# EAGLE design Escorna_CPU_2_12 (EAGLE 6.4)
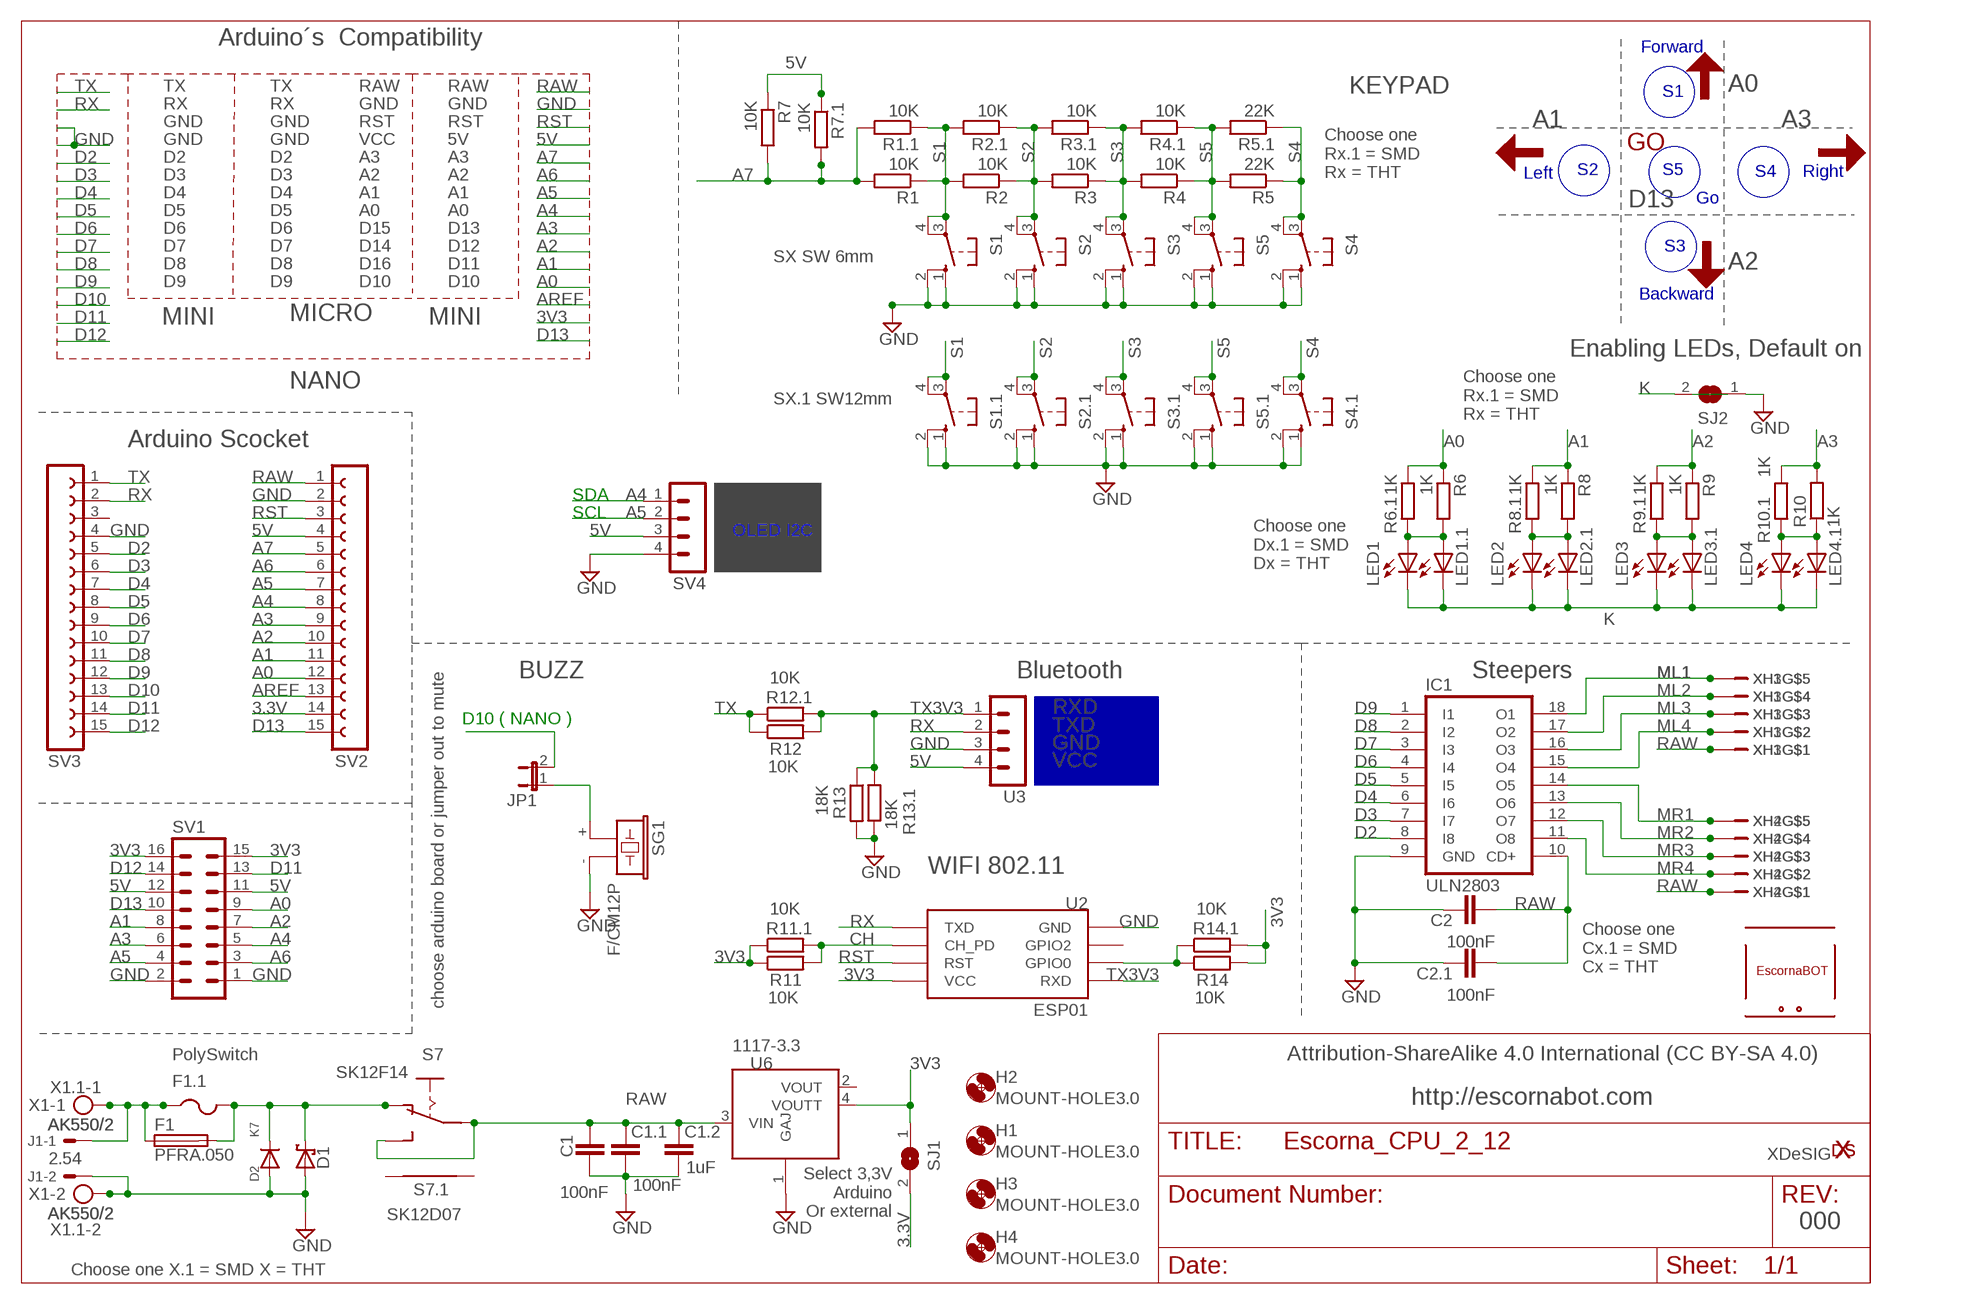
[diagram p0: schematic, sheet 1]

## Parts
C1  100nF  C-EU025-025X050  [C025-025X050]
C1.1  100nF  C-EUC1206  [C1206]
C1.2  1uF  C-EUC1206  [C1206]
C2  100nF  C-EU025-025X050  [C025-025X050]
C2.1  100nF  C-EUC1206  [C1206]
D1  1N5817  P4KEXX  [DO41-10]
D2  K7  DIODESMA  [SMADIODE]
ESC  ESCORNABOT  [ESCORNA_PEQUE]
F1  PFRA.050  FUSETE5  [TE5]
F1.1  PolySwitch  PTCFUSE-1206  [R1206]
H1  MOUNT-HOLE3.0  [3,0]
H2  MOUNT-HOLE3.0  [3,0]
H3  MOUNT-HOLE3.0  [3,0]
H4  MOUNT-HOLE3.0  [3,0]
IC1  ULN2803  ULN2803A  [DIL18]
J1  2.54  22-27-2021-02  [6410-02]
JP1  JP1E  [JP1]
LED1  LED3MM  [LED3MM]
LED1.1  LEDCHIPLED_0603  [CHIPLED_0603]
LED2  LED3MM  [LED3MM]
LED2.1  LEDCHIPLED_0603  [CHIPLED_0603]
LED3  LED3MM  [LED3MM]
LED3.1  LEDCHIPLED_0603  [CHIPLED_0603]
LED4  LED3MM  [LED3MM]
LED4.1  LEDCHIPLED_0603  [CHIPLED_0603]
R1  10K  R-EU_0204/7  [0204/7]
R1.1  10K  R-EU_R0603  [R0603]
R2  10K  R-EU_0204/7  [0204/7]
R2.1  10K  R-EU_R0603  [R0603]
R3  10K  R-EU_0204/7  [0204/7]
R3.1  10K  R-EU_R0603  [R0603]
R4  10K  R-EU_0204/7  [0204/7]
R4.1  10K  R-EU_R0603  [R0603]
R5  22K  R-EU_0204/7  [0204/7]
R5.1  22K  R-EU_R0603  [R0603]
R6  1K  R-EU_0204/7  [0204/7]
R6.1  1K  R-EU_R0603  [R0603]
R7  10K  R-EU_0204/7  [0204/7]
R7.1  10K  R-EU_R0603  [R0603]
R8  1K  R-EU_0204/7  [0204/7]
R8.1  1K  R-EU_R0603  [R0603]
R9  1K  R-EU_0204/7  [0204/7]
R9.1  1K  R-EU_R0603  [R0603]
R10  1K  R-EU_0204/7  [0204/7]
R10.1  1K  R-EU_R0603  [R0603]
R11  10K  R-EU_0204/7  [0204/7]
R11.1  10K  R-EU_R0603  [R0603]
R12  10K  R-EU_0204/7  [0204/7]
R12.1  10K  R-EU_R0603  [R0603]
R13  18K  R-EU_0204/7  [0204/7]
R13.1  18K  R-EU_R0603  [R0603]
R14  10K  R-EU_0204/7  [0204/7]
R14.1  10K  R-EU_R0603  [R0603]
S1  10-XX  [B3F-10XX]
S1.1  40-XX  [B3F-40XX]
S2  10-XX  [B3F-10XX]
S2.1  40-XX  [B3F-40XX]
S3  10-XX  [B3F-10XX]
S3.1  40-XX  [B3F-40XX]
S4  10-XX  [B3F-10XX]
S4.1  40-XX  [B3F-40XX]
S5  10-XX  [B3F-10XX]
S5.1  40-XX  [B3F-40XX]
S7  SK12F14  ESCORNA_SK12F14F  [ESCORNA_SK-12F14-G]
S7.1  SK12D07  ESCORNA_SK12F14D  [ESCORNA_SK-12D07]
SG1  F/CM12P  [F/CM12P]
SJ1  SJ  [SJ]
SJ2  SJ  [SJ]
SV1  MA08-2  [MA08-2]
SV2  CON-LSTA_FE15-1  [CON-LSTA_FE15]
SV3  CON-LSTA_FE15-1  [CON-LSTA_FE15]
SV4  MA04-1  [MA04-1]
U2  ESP01  [ESP01]
U3  MA04-1  [MA04-1]
U6  1117-3.3  ASM1117-3.3  [SOT223]
U$1  FRECHA  [FRECHA]
U$2  GO  [VALE]
U$3  FRECHA  [FRECHA]
U$6  FRECHA  [FRECHA]
U$11  FRECHA  [FRECHA]
U$13  XDESIG_XDESIG21  [XDESIG_XDESIG]
X1  AK550/2  [AK550/2]
X1.1  AK550/2  [AK550/2]
XDS1  XDESIG  [XDESIG_CU_2]
XH1  B5B-XH-A  [B5B-XH-A]
XH2  B5B-XH-A  [B5B-XH-A]
XH3  B5B-XH-A  [B5B-XH-A]
XH4  B5B-XH-A  [B5B-XH-A]

## Nets
3.3V: SJ1.2 SV2.14
3V3: R11.1 R11.1.1 R14.1.2 R14.2 SJ1.1 SV1.15 SV1.16 U2.VCC U6.4(VOUTT)
5V: R7.1 R7.1.1 SV1.11 SV1.12 SV2.4 SV4.3 U3.4
A0: R6.1 R6.1.1 SV1.9 SV2.12
A1: R8.1 R8.1.1 SV1.8 SV2.11
A2: R9.1 R9.1.1 SV1.7 SV2.10
A3: R10.1.1 R10.2 SV1.6 SV2.9
A4: SV1.5 SV2.8 SV4.1
A5: SV1.4 SV2.7 SV4.2
A6: SV1.3 SV2.6
A7: R1.1.2 R1.2 R7.1.2 R7.2 SV2.5
AREF: SV2.13
CH: R11.1.2 R11.2 U2.CH_PD
D2: IC1.8(I8) SV3.5
D3: IC1.7(I7) SV3.6
D4: IC1.6(I6) SV3.7
D5: IC1.5(I5) SV3.8
D6: IC1.4(I4) SV3.9
D7: IC1.3(I3) SV3.10
D8: IC1.2(I2) SV3.11
D9: IC1.1(I1) SV3.12
D10: JP1.2 SV3.13
D11: SV1.13 SV3.14
D12: SV1.14 SV3.15
D13: SV1.10 SV2.15
GND: C1.1 C1.1.1 C1.2.1 C2.1 C2.1.1 D1.A D2.A IC1.9(GND) J1.2 R13.1.1 R13.2 S1.1(S) S1.1.1(S) S1.1.2(S1) S1.2(S1) S2.1(S) S2.1.1(S) S2.1.2(S1) S2.2(S1) S3.1(S) S3.1.1(S) S3.1.2(S1) S3.2(S1) S4.1(S) S4.1.1(S) S4.1.2(S1) S4.2(S1) S5.1(S) S5.1.1(S) S5.1.2(S1) S5.2(S1) SG1.- SJ2.1 SV1.1 SV1.2 SV2.2 SV3.4 SV4.4 U2.GND U3.3 U6.1(GAJ) X1.1.2 X1.2
K: LED1.1.C LED1.K(C) LED2.1.C LED2.K(C) LED3.1.C LED3.K(C) LED4.1.C LED4.K(C) SJ2.2
ML1: IC1.18(O1) XH1.P$5 XH3.P$5
ML2: IC1.17(O2) XH1.P$4 XH3.P$4
ML3: IC1.16(O3) XH1.P$3 XH3.P$3
ML4: IC1.15(O4) XH1.P$2 XH3.P$2
MR1: IC1.14(O5) XH2.P$5 XH4.P$5
MR2: IC1.13(O6) XH2.P$4 XH4.P$4
MR3: IC1.12(O7) XH2.P$3 XH4.P$3
MR4: IC1.11(O8) XH2.P$2 XH4.P$2
N$2: JP1.1 SG1.+
N$3: D1.C D2.C F1.1.2 F1.2 S7.1.P$2(O) S7.P$2(O)
N$4: LED2.1.A LED2.A R8.1.2 R8.2
N$5: LED1.1.A LED1.A R6.1.2 R6.2
N$6: LED3.1.A LED3.A R9.1.2 R9.2
N$8: LED4.1.A LED4.A R10.1 R10.1.2
N$10: S7.1.P$5 S7.P$5
N$11: S7.1.P$4 S7.P$4
N$12: F1.1 F1.1.1 J1.1 X1.1 X1.1.1
N$14: R14.1 R14.1.1 U2.GPIO0
RAW: C1.1.2 C1.2 C1.2.2 C2.1.2 C2.2 IC1.10(CD+) S7.1.P$1(P) S7.1.P$3(S) S7.P$1(P) S7.P$3(S) SV2.1 U6.3(VIN) XH1.P$1 XH2.P$1 XH3.P$1 XH4.P$1
RST: SV2.3 U2.RST
RX: SV3.2 U2.TX(TXD) U3.2
S1: R1.1 R1.1.1 R2.1.2 R2.2 S1.1.3(P) S1.1.4(P1) S1.3(P) S1.4(P1)
S2: R2.1 R2.1.1 R3.1.2 R3.2 S2.1.3(P) S2.1.4(P1) S2.3(P) S2.4(P1)
S3: R3.1 R3.1.1 R4.1.2 R4.2 S3.1.3(P) S3.1.4(P1) S3.3(P) S3.4(P1)
S4: R5.1 R5.1.1 S4.1.3(P) S4.1.4(P1) S4.3(P) S4.4(P1)
S5: R4.1 R4.1.1 R5.1.2 R5.2 S5.1.3(P) S5.1.4(P1) S5.3(P) S5.4(P1)
TX: R12.1 R12.1.1 SV3.1
TX3V3: R12.1.2 R12.2 R13.1 R13.1.2 U2.RX(RXD) U3.1
Unconnected: SV3.3 U2.GPIO2 U6.2(VOUT)

## Notes on the sheet
- Arduino´s  Compatibility
- Forward
- TX | TX | RAW | RAW | KEYPAD | A0
- S1
- RX | RX | GND | GND
- GND | GND | RST | RST | A1 | A3
- GND | GND | VCC | 5V
- D2 | D2 | A3 | A3
- Left | S2 | S5 | S4 | Right
- D3 | D3 | A2 | A2
- Choose one
  Rx.1 = SMD
  Rx = THT
- D4 | D4 | A1 | A1
- D13 | Go
- D5 | D5 | A0 | A0
- D6 | D6 | D15 | D13
- D7 | D7 | D14 | D12 | S3
- SX SW 6mm
- D8 | D8 | D16 | D11 | A2
- D9 | D9 | D10 | D10
- Backward
- MINI | MINI
- MICRO
- Enabling LEDs, Default on
- NANO
- SX.1 SW12mm
- Choose one
  Rx.1 = SMD
  Rx = THT
- Arduino Scocket
- SDA
- SCL
- OLED I2C
- Choose one
  Dx.1 = SMD
  Dx = THT
- choose arduino board or jumper out to mute
- BUZZ | Bluetooth | Steepers
- RXD
- D10 ( NANO )
- TXD
- GND
- VCC
- WIFI 802.11
- Choose one
  Cx.1 = SMD
  Cx = THT
- Attribution-ShareAlike 4.0 International (CC BY-SA 4.0)
- http://escornabot.com
- XDeSIG
- Select 3,3V
  Arduino
  Or external
- 000
- Choose one X.1 = SMD X = THT

## Library data of the parts
C1 C1.1 C1.2 C2 C2.1 = rcl:C-EU: CAPACITOR, European symbol
D1 = diode:P4KEXX: DIODE transient-voltage suppressor
D2 = adafruit:DIODE: Diode SMADIODE - SMA Surface Mount Package 20V 1A Schottky Diode Digikey: 641-1014-6-ND DO-1N4148 - Through Hole Small Current Diode SOD-123 20V 1 A (.5mV Vf) Schottky Diode - Digikey: MBRX120TPMSCT-ND SOD-323 10V 570mA (.38mV Vf, 3ns) Schottky Diode - Digikey: ZLLS410CT-ND SOD-523 30V 30mA Schottky Diode (RB751S-40TE61) - Digikey: RB751S-40TE61CT-ND SOT23-R/W - SOT23 Package (R = Solder Paste/Reflow Ovens, W = Hand-Soldering) BAT54Film 40V 300mA - Digikey: 497-7162-1-ND
ESC = escorna:ESCORNABOT
F1 = fuse:FUSE: Fuse; OC_FARNELL: unknown; OC_NEWARK: unknown
F1.1 = adafruit:PTCFUSE: PTC fuses, resettable thermistors
H1-H4 = holes:MOUNT-HOLE: MOUNTING HOLE with drill center marker
IC1 = uln-udn:ULN2803A: DRIVER ARRAY
J1 = con-molex:22-?-02: CONNECTOR wire to board 2.54 mm (.1 inch) pitch header; OC_FARNELL: unknown; OC_NEWARK: unknown
JP1 = jumper:JP1E: JUMPER
LED1 LED1.1 LED2 LED2.1 LED3 LED3.1 LED4 LED4.1 = adafruit:LED: LED OSRAM: - CHIPLED LG R971, LG N971, LY N971, LG Q971, LY Q971, LO R971, LY R971 LH N974, LH R974 LS Q976, LO Q976, LY Q976 LO Q996 - Hyper CHIPLED LW Q18S LB Q993, LB Q99A, LB R99A - SideLED LS A670, LO A670, LY A670, LG A670, LP A670 LB A673, LV A673, LT A673, LW A673 LH A674 LY A675 LS A676, LA A676, LO A676, LY A676, LW A676 LS A679, LY A679, LG A679 - Hyper Micro SIDELED® LS Y876, LA Y876, LO Y876, LY Y876 LT Y87S - SmartLED LW L88C, LW L88S LB L89C, LB L89S, LG L890 LS L89K, LO L89K, LY L89K LS L896, LA L896, LO L896, LY L896 - TOPLED LS T670, LO T670, LY T670, LG T670, LP T670 LSG T670, LSP T670, LSY T670, LOP T670, LYG T670 LG T671, LOG T671, LSG T671 LB T673, LV T673, LT T673, LW T673 LH T674 LS T676, LA T676, LO T676, LY T676, LB T676, LH T676, LSB T676, LW T676 LB T67C, LV T67C, LT T67C, LS T67K, LO T67K, LY T67K, LW E67C LS E67B, LA E67B, LO E67B, LY E67B, LB E67C, LV E67C, LT E67C LW T67C LS T679, LY T679, LG T679 LS T770, LO T770, LY T770, LG T770, LP T770 LB T773, LV T773, LT T773, LW T773 LH T774 LS E675, LA E675, LY E675, LS T675 LS T776, LA T776, LO T776, LY T776, LB T776 LHGB T686 LT T68C, LB T68C - Hyper Mini TOPLED® LB M676 - Mini TOPLED Santana® LG M470 LS M47K, LO M47K, LY M47K Source: http://www.osram.convergy.de/
R1 R1.1 R2 R2.1 R3 R3.1 R4 R4.1 R5 R5.1 R6 R6.1 R7 R7.1 R8 R8.1 R9 R9.1 R10 R10.1 R11 R11.1 R12 R12.1 R13 R13.1 R14 R14.1 = rcl:R-EU_: RESISTOR, European symbol
S1-S5 = switch-omron:10-XX: OMRON SWITCH; MPN: B3F-1000; OC_FARNELL: 176432; OC_NEWARK: 36M3542
S1.1 S2.1 S3.1 S4.1 S5.1 = switch-omron:40-XX: OMRON SWITCH; MF: OMRON COMPONENTS USA; MPN: B3F-4000; OC_FARNELL: 176434; OC_NEWARK: 36K3105
S7 S7.1 = escorna_ELIB:ESCORNA_SK12F14
SG1 = buzzer:F/CM12P: BUZZER Source: Buerklin; OC_FARNELL: unknown; OC_NEWARK: unknown
SJ1 SJ2 = jumper:SJ: SMD solder JUMPER
SV1 = con-lstb:MA08-2: PIN HEADER; OC_FARNELL: unknown; OC_NEWARK: unknown
SV2 SV3 = escorna_LBREscorna_CPU_2_10:CON-LSTA_FE15-1: FEMALE HEADER; OC_FARNELL: unknown; OC_NEWARK: unknown
SV4 U3 = con-lstb:MA04-1: PIN HEADER; OC_FARNELL: unknown; OC_NEWARK: unknown
U2 = esp8266modules:ESP01: ESP8266 Wifi module 01
U6 = Itead_IC_110429:ASM1117-3.3: ICP006
U$1 U$3 U$6 U$11 = escorna:FRECHA
U$2 = escorna:GO
U$13 = Escorna_CPU_2_01:XDESIG_XDESIG
X1 X1.1 = con-ptr500:AK550/2: CONNECTOR; OC_FARNELL: unknown; OC_NEWARK: unknown
XDS1 = xdesig:XDESIG
XH1-XH4 = con-jst:B5B-XH-A

## Net classes
0 default: width 0.254 mm, drill 0.61 mm, clearance 0.254 mm
1 power: width 0.254 mm, drill 0.61 mm, clearance 0.254 mm

## Board
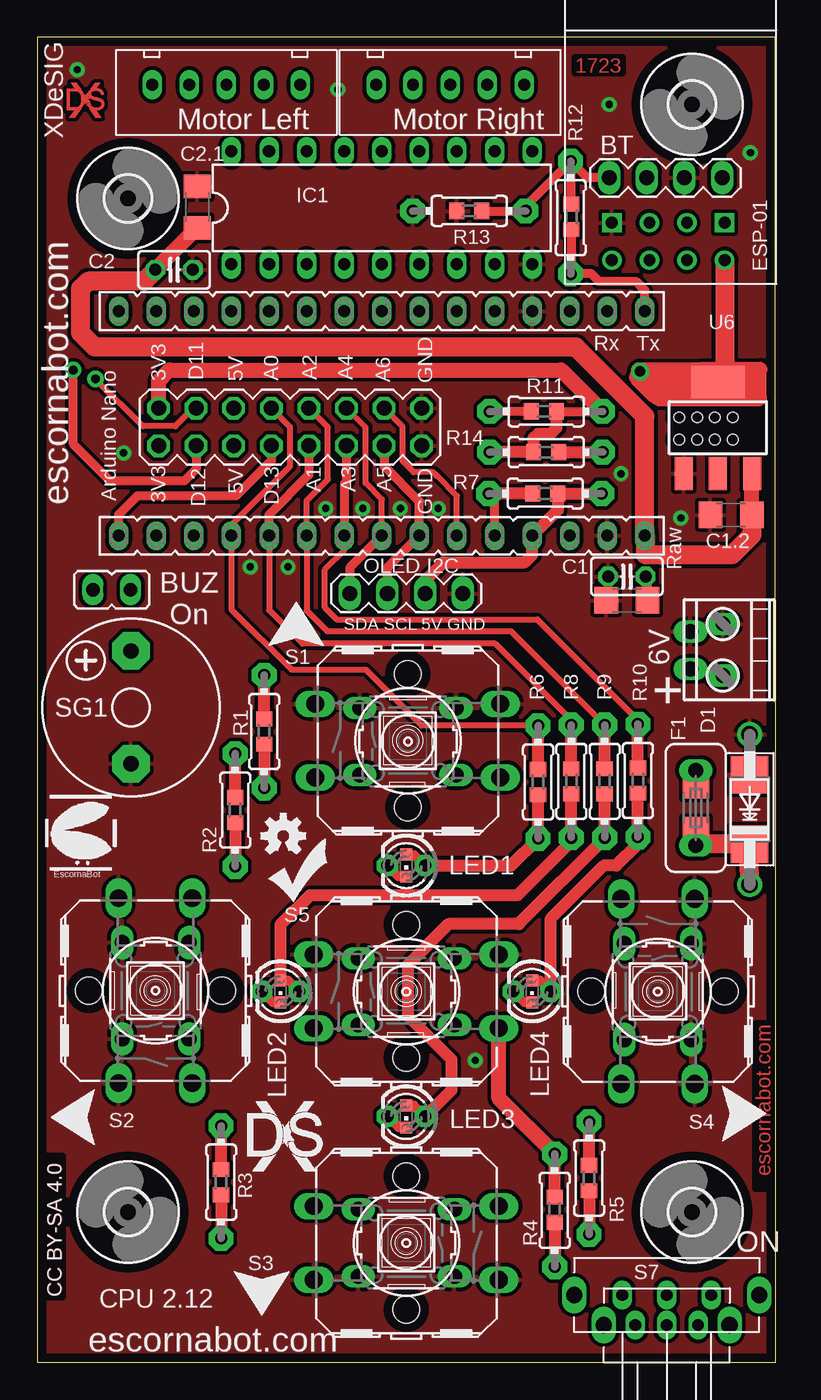
[diagram p1: board, top side]
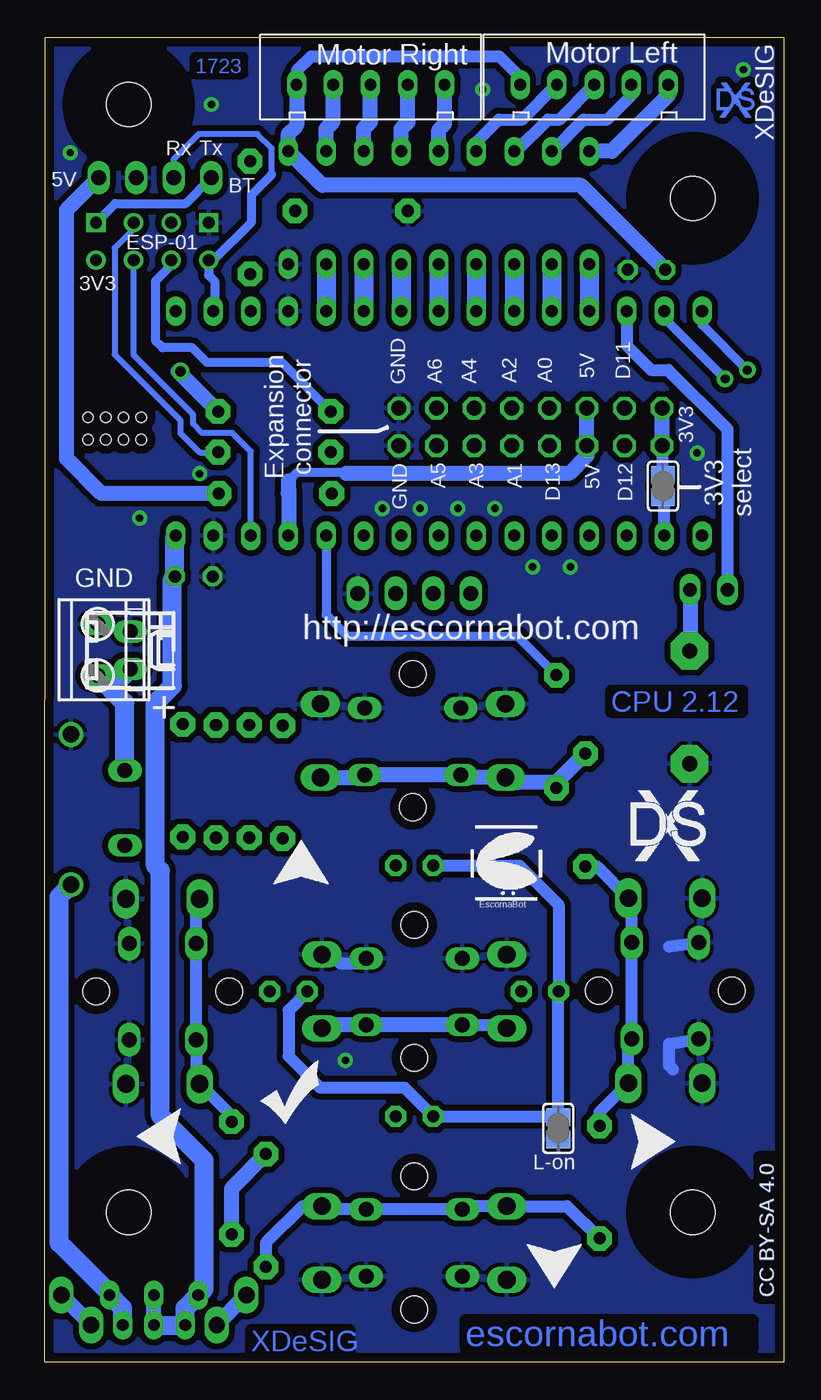
[diagram p2: board, bottom side, seen from below]

Size 49.91 x 89.59 mm. Coordinates in mm from the lower left corner, seen from the top.
Outline: 49.91,0 49.89,89.59 0,89.59 0,0 49.91,0
Copper layers (1*16): Top 0.035mm / dielectric 1.5mm / Bottom 0.035mm
Design rules "default": minimum track width 10mil, minimum drill 22mil, track to track 10mil, track to pad 10mil, pad to pad 8mil, via to via 12mil, smd to smd 8mil, copper to edge 24mil, drill to drill 12mil, minimum pad ring 10mil, minimum via ring 10mil, stop-mask expansion 2mil, vias tented up to drill 30mil, thermal gap 10mil
Holes 0.7 mm at 43.4,63.88 44.6,63.88 45.8,63.88 47,63.88 43.4,62.38 44.6,62.38 45.8,62.38 47,62.38

### Footprints (pad centres in the part's own frame; a part is rotated, then mirrored left to right if it is on the bottom)
C025-025X050 = drill 0.813 octagon: 1 -1.27,0; 2 1.27,0
C1206 = smd 1.6 x 1.8: 1 -1.4,0; 2 1.4,0
DO41-10 = drill 1.118: A 5.08,0; C -5.08,0
SMADIODE = smd 2.54 x 2.54: A 2.349,0; C -2.349,0
TE5 = drill 1.016 long: 1 -2.54,0; 2 2.54,0
R1206 = smd 1.6 x 1.803: 1 -1.422,0; 2 1.422,0
3,0 = hole 3: 0,0
DIL18 = drill 0.813 long: 1 -10.16,-3.81; 2 -7.62,-3.81; 3 -5.08,-3.81; 4 -2.54,-3.81; 5 0,-3.81; 6 2.54,-3.81; 7 5.08,-3.81; 8 7.62,-3.81; 9 10.16,-3.81; 10 10.16,3.81; 11 7.62,3.81; 12 5.08,3.81; 13 2.54,3.81; 14 0,3.81; 15 -2.54,3.81; 16 -5.08,3.81; 17 -7.62,3.81; 18 -10.16,3.81
6410-02 = drill 1.016 long: 1 1.27,0; 2 -1.27,0
JP1 = drill 0.914 long: 1 0,-1.27; 2 0,1.27
LED3MM = drill 0.813 pad 1.422 octagon: A -1.27,0; K 1.27,0
CHIPLED_0603 = smd 0.8 x 0.8: A 0,-0.75; C 0,0.75
0204/7 = drill 0.813 pad 1.676 octagon: 1 -3.81,0; 2 3.81,0
R0603 = smd 1 x 1.1: 1 -0.85,0; 2 0.85,0
B3F-10XX = drill 1.016 long: 1 -3.251,2.261; 2 3.251,2.261; 3 -3.251,-2.261; 4 3.251,-2.261
B3F-40XX = drill 1.194 long: 1 -6.248,2.489; 2 6.248,2.489; 3 -6.248,-2.489; 4 6.248,-2.489 | hole 1.803: 0,-4.496; 0,4.496
ESCORNA_SK-12F14-G = drill 0.8 long: P$1 0,0; P$2 3,0; P$3 -3,0 | drill 1.1 long: P$4 -6.25,0; P$5 6.25,0
ESCORNA_SK-12D07 = drill 0.8 long: P$1 0,0; P$2 2.115,0; P$3 -2.115,0 | drill 1.1 pad 1.27 long: P$4 -4.25,0; P$5 4.25,0
F/CM12P = drill 1.016 pad 2.54 octagon: + 3.81,0; - -3.81,0
SJ = smd 1.168 x 1.6: 1 -0.762,0; 2 0.762,0
MA08-2 = drill 1.016 octagon: 1 -8.89,-1.27; 2 -8.89,1.27; 3 -6.35,-1.27; 4 -6.35,1.27; 5 -3.81,-1.27; 6 -3.81,1.27; 7 -1.27,-1.27; 8 -1.27,1.27; 9 1.27,-1.27; 10 1.27,1.27; 11 3.81,-1.27; 12 3.81,1.27; 13 6.35,-1.27; 14 6.35,1.27; 15 8.89,-1.27; 16 8.89,1.27
CON-LSTA_FE15 = drill 0.813 long: 1 -17.78,0; 2 -15.24,0; 3 -12.7,0; 4 -10.16,0; 5 -7.62,0; 6 -5.08,0; 7 -2.54,0; 8 0,0; 9 2.54,0; 10 5.08,0; 11 7.62,0; 12 10.16,0; 13 12.7,0; 14 15.24,0; 15 17.78,0
MA04-1 = drill 1.016 long: 1 -3.81,0; 2 -1.27,0; 3 1.27,0; 4 3.81,0
ESP01 = drill 0.8: CH_PD -1.285,-8.178; GPIO0 1.255,-5.638; GPIO2 -1.285,-5.638; RST 1.255,-8.178; TX -3.825,-8.178; VCC 3.795,-8.178 | drill 0.8 square: GND -3.825,-5.638; RX 3.795,-5.638
SOT223 = smd 1.219 x 2.235: 1 -2.311,-3.099; 2 0,-3.099; 3 2.311,-3.099 | smd 3.6 x 2.2: 4 0,3.099
AK550/2 = drill 1 pad 1.5 long: 1 -1.75,0; 2 1.75,0
B5B-XH-A = drill 0.8 long: P$1 -5.17,-0.19; P$2 -2.69,-0.175; P$3 -0.175,-0.175; P$4 2.34,-0.175; P$5 4.83,-0.175

### Placement (x,y rotation side)
C1  39.85,53.13 0 top
C1.1  39.86,51.5 0 top
C1.2  46.9,57.28 0 top
C2  9.26,73.85 180 top
C2.1  10.82,78.09 270 top
D1  48.15,37.37 90 top
D2  48.15,37.38 90 top
ESC  21.2,31.16 0 bottom
F1  44.5,37.48 270 top
F1.1  44.52,37.49 270 top
H1  44.25,10.16 90 top
H2  6.15,10.16 90 top
H3  44.25,85.03 0 top
H4  6.15,78.68 0 top
IC1  23.29,78.04 0 top
J1  44.15,48.13 270 bottom
JP1  5.05,52.23 90 top
LED1  24.95,33.58 180 top
LED1.1  24.95,33.58 180 top
LED2  16.45,25.08 180 top
LED2.1  16.45,25.08 180 top
LED3  24.95,16.63 180 top
LED3.1  24.95,16.63 180 top
LED4  33.45,25.08 180 top
LED4.1  33.45,25.08 180 top
LOGO1  OSHW-LOGOS  [OSHW-LOGO-S]  16.63,35.59 0 top
R1  15.35,42.64 90 top
R1.1  15.35,42.64 90 top
R2  13.39,37.34 90 top
R2.1  13.39,37.34 90 top
R3  12.44,12.19 90 top
R3.1  12.44,12.19 90 top
R4  34.97,10.28 270 top
R4.1  34.97,10.33 270 top
R5  37.3,12.47 270 top
R5.1  37.3,12.47 270 top
R6  33.85,39.23 270 top
R6.1  33.85,39.23 270 top
R7  34.34,58.73 180 top
R7.1  34.34,58.73 180 top
R8  36.1,39.28 270 top
R8.1  36.1,39.28 270 top
R9  38.35,39.28 270 top
R9.1  38.35,39.28 270 top
R10  40.6,39.33 90 top
R10.1  40.6,39.33 270 top
R11  34.4,64.28 180 top
R11.1  34.25,64.28 180 top
R12  36.05,77.38 90 top
R12.1  36.1,77.43 90 top
R13  29.2,77.83 180 top
R13.1  29.2,77.83 0 top
R14  34.4,61.53 180 top
R14.1  34.4,61.53 180 top
S1  25.06,41.98 0 top
S1.1  25.05,42.03 0 top
S2  8.01,25.13 90 top
S2.1  8,25.13 90 top
S3  24.95,8.08 180 top
S3.1  24.95,8.08 180 top
S4  41.94,25.06 270 top
S4.1  41.95,25.08 270 top
S5  24.95,25.06 0 top
S5.1  24.95,25.08 0 top
S7  42.54,4.56 0 top
S7.1  42.54,2.53 0 top
SG1  6.35,44.28 90 top
SJ1  8.15,59.23 270 bottom
SJ2  15.23,15.83 90 bottom
SV1  17.1,63.23 180 top
SV2  23.29,55.88 180 top
SV3  23.29,71.06 180 top
SV4  24.95,51.98 0 top
U2  42.66,82.68 0 top
U3  42.47,80.07 0 top
U6  46,63.18 0 top
U$1  40.69,17.21 180 bottom
U$2  35.38,16.08 0 bottom
U$3  10.34,13.01 0 bottom
U$4  FRECHA  [FRECHA]  13.26,6.19 270 top
U$5  ESCORNABOT  [ESCORNA_PEQUE]  0.5,33.2 0 top
U$6  17.42,8.04 270 bottom
U$7  FRECHA  [FRECHA]  46.26,14.9 0 top
U$8  FRECHA  [FRECHA]  19.44,48.41 90 top
U$9  FRECHA  [FRECHA]  3.94,18.5 180 top
U$10  GO  [VALE]  15.6,31.1 0 top
U$11  30.67,32.29 90 bottom
U$12  XDESIG_XDESIG21  [XDESIG_XDESIG]  14.23,12.92 0 top
U$13  10.33,33.92 0 bottom
X1  46.34,48.17 90 bottom
X1.1  46.34,48.17 90 top
XDS  XDESIG  [XDESIG_CU_2]  2.02,84.14 0 top
XDS1  4.5,84.14 0 bottom
XH1  12.63,86.55 0 bottom
XH2  27.74,86.55 0 bottom
XH3  12.63,86.17 180 top
XH4  27.74,86.17 180 top

### Tracks (layer width: path | path; a pad name or v marks a point on that pad's centre or on a via)
3.3V
  Bottom 0.813: SV2.14 8.05,58.37 SJ1.2
3V3  (via drill 0.7)
  Top 0.61: R11.1.1 R11.1 | 45.95,66.23 U6.4
  Top 0.813: R14.2 R14.1.2 33.55,62.48 33.85,62.78 34.7,62.78 35.1,63.18 R11.1.1
  Top 1.016: SV1.15 8.21,66.34 8.95,67.08 35.41,67.08 R11.1 | v40.75,66.98 47.25,66.98 47.35,66.88 42.15,66.88 40.7,67.08 40.5,66.58 | 41.75,65.33 44.45,66.08 44.7,66.33 44.7,65.88 44.5,65.68 42.2,65.68 40.5,66.58 | 40.5,66.58 41.75,65.33 | 41.75,65.33 42.05,65.13 48.75,65.13 48.8,65.18 48.8,67.08 48.85,67.13 40.65,67.08 42.1,67.08 42.1,66.48 42.2,66.38 45.9,66.38 U6.4 47.7,66.28 48.15,66.73 48.15,65.93 48.1,65.88 47.16,65.88 46.46,66.59
  Top 1.27: U2.VCC 46.46,66.59 46.45,66.58
  Bottom 0.813: SJ1.1 8.15,62.08 8.15,62.56
  Bottom 1.016: SV1.15 SV1.16 8.21,62.02 8.15,62.08 | v40.75,66.98 40.91,66.98 R11.1
5V
  Top 0.61: 35.2,58.72 R7.1.1 | 26.22,52.85 SV4.3
  Top 0.813: 26.22,52.85 27.45,54.08 32.95,54.08 33.45,54.58 SV2.4 35.19,57.61 R7.1.1 R7.1
  Bottom 0.61: 33.45,59.58 32.9,60.13 29.6,60.13 29.55,60.08
  Bottom 0.813: 33.45,59.08 33.45,58.88 33.6,58.73 | R7.1
  Bottom 1.016: SV2.4 33.45,59.08 33.45,59.58 | U3.4 48.45,77.91 48.45,61.08 46.1,58.73 R7.1 | 29.55,60.08 14.5,60.08 13.29,61.29 SV1.12 SV1.11
A0
  Top 0.406: R6.1 25.99,43.04 22.2,46.83 17.2,46.83 13.13,50.9 SV2.12 13.13,56.61 17.1,60.58 17.1,63.23 SV1.9
  Top 0.813: R6.1.1 R6.1
A1
  Top 0.406: 15.65,55.91 SV2.11 15.67,50.86 17.95,48.58 30.95,48.58 36.1,43.43 R8.1
  Top 0.61: SV2.11 15.67,57.3 18.37,60 SV1.8
  Top 0.813: R8.1.1 R8.1
A2
  Top 0.406: R9.1 32.01,49.43 19.6,49.43 18.21,50.82 SV2.10 18.21,58.24 19.65,59.68 19.65,63.22 SV1.7
  Top 0.813: R9.1.1 R9.1
A3
  Top 0.406: R10.2 40.6,43.43 33.8,50.23 20.25,50.23 19.45,51.03 19.45,53.58 20.75,54.88 SV2.9
  Top 0.61: 20.78,55.91 20.78,59.41 20.95,59.58 20.91,59.62 SV1.6
  Top 0.813: R10.1.1 R10.2 | 20.78,55.91 SV2.9
A4
  Top 0.406: SV2.8 23.29,58.34 22.2,59.43 22.2,63.21 SV1.5
  Top 0.61: SV2.8 21.14,53.73 SV4.1
A5
  Top 0.61: SV1.4 23.45,60.58 25.83,58.2 SV2.7 23.68,53.73 SV4.2
A6
  Top 0.406: SV1.3 24.7,63.25 24.7,60.93 25.45,60.18 26.75,60.18 27,59.93 27.02,59.93 28.37,58.58 SV2.6
A7
  Top 0.61: SV2.5 30.91,58.34 R7.2
  Top 0.813: R1.1.2 R1.2 | R7.1.2 R7.2
  Bottom 0.61: R1.2 15.35,46.48 17.95,49.08 29.45,49.08 30.91,50.55 SV2.5
CH
  Top 0.61: R11.1.2 R11.2
  Bottom 0.61: U2.CH_PD 41.38,74.15 42.45,73.08 42.45,69.08 41.95,68.58 39.95,68.58 38.95,67.58 33.89,67.58 R11.2
D2
  Bottom 1.27: IC1.8 SV3.5
D3
  Bottom 1.27: IC1.7 SV3.6
D4
  Bottom 1.27: IC1.6 SV3.7
D5
  Bottom 1.27: IC1.5 SV3.8
D6
  Bottom 1.27: IC1.4 SV3.9
D7
  Bottom 1.27: IC1.3 SV3.10
D8
  Bottom 1.27: IC1.2 SV3.11
D9
  Bottom 1.27: IC1.1 SV3.12
D10
  Bottom 0.813: 10.59,70.72 SV3.13 10.59,68.72 8.95,67.08 7.78,67.08 3.78,63.08 JP1.2
D11  (via drill 0.6)
  Top 0.406: v3.95,66.48 7.15,63.28 9.35,63.28 10.57,64.5 SV1.13
  Bottom 0.61: SV3.14 8.05,70.58 v3.95,66.48
D12  (via drill 0.6)
  Top 0.61: v2.45,67.08 2.45,62.08 4.95,59.58 9.95,59.58 10.75,60.38 SV1.14
  Bottom 0.61: SV3.15 5.51,70.14 v2.45,67.08
D13
  Top 0.61: SV2.15 5.51,57.3 6.8,58.58 13.45,58.58 15.83,60.96 SV1.10
GND  (via drill 0.5 pad 0.25)
  Top 0.813: 10.81,74.13 C2.1
  Bottom 0.61: IC1.9 33.71,74.23
  Bottom 0.813: 7.47,19.8 7.74,20.07 7.74,21.54 S2.1 | 7.74,28.12 S2.2 | 30.23,27.25 29.96,26.99 28.49,26.99 S5.2
  other vias: 38.66,85.03 2.72,87.38 48.2,81.77 20.33,86.04 16.96,53.77 29.61,20.42 14.41,53.77 5.85,61.47 39.46,60.07 19.51,57.72 22.01,57.72 24.56,57.72 27.11,57.72 43.51,57.07
  pour Bottom (isolate 0.406): -0.05,90.08 49.95,90.08 49.95,0.08 -0.05,0.08
  pour Top: -0.55,90.58 50.45,90.58 49.95,0.08 -1.05,0.08
K
  Top 0.61: LED1.1.C 24.43,32.83 LED1.K | LED4.1.C 32.93,24.33 LED4.K | LED2.1.C 15.93,24.33 LED2.K | LED3.1.C 24.43,15.88 LED3.K
  Bottom 0.813: LED1.K 17.85,33.58 15.2,30.93 15.2,25.1 LED2.K 15.23,25.03 SJ2.2 15.28,16.63 LED3.K 25.63,18.58 31.33,18.58 33.45,20.7 33.45,23.81 LED4.K
ML1
  Bottom 0.406: XH1.P$5 XH3.P$5
  Bottom 1.016: XH1.P$5 7.73,85.73 11.61,81.85 IC1.18
ML2
  Bottom 0.813: IC1.17 15.61,81.85 13.52,84.01 11.92,84.01 10.3,85.63 XH3.P$4
  Bottom 1.016: XH3.P$4 XH1.P$4
ML3
  Bottom 0.813: IC1.16 18.09,81.85 15.93,84.01 15.13,84.01 XH3.P$3
  Bottom 1.016: XH3.P$3 XH1.P$3
ML4
  Bottom 0.813: IC1.15 20.75,82.49 19.23,84.01 17.65,84.01 XH3.P$2
  Bottom 1.016: XH3.P$2 XH1.P$2
MR1
  Bottom 1.016: IC1.14 23.29,83.31 22.91,83.7 XH4.P$5 XH2.P$5
MR2
  Bottom 1.016: IC1.13 25.83,83.38 25.39,83.82 25.4,83.83 XH4.P$4 XH2.P$4
MR3
  Bottom 1.016: IC1.12 28.37,83.38 27.91,83.83 XH4.P$3 XH2.P$3
MR4
  Bottom 1.016: IC1.11 30.91,83.38 30.43,83.86 XH4.P$2 XH2.P$2
N$1
  Bottom 0.254: 15.25,16.63 15.25,15.13
N$2
  Bottom 0.61: SG1.+ 6.35,48.14 6.32,48.17
  Bottom 1.016: JP1.1 6.32,48.17
N$3
  Top 1.27: D1.C 48.05,34.14 D2.C 44.59,35.03 F1.2 44.5,36.05 F1.1.2
  Bottom 1.27: S7.1.P$2 44.66,3.68 S7.P$2 45.54,4.67 48.95,8.08 48.95,31.49 D1.C
N$4
  Top 0.61: LED2.1.A 16.97,25.83 LED2.A
  Top 0.813: 17.77,25.13 LED2.A | LED2.1.A 16.45,29.58 18.45,31.58 32.45,31.58 36.1,35.23 R8.2 R8.1.2
N$5
  Top 0.61: LED1.1.A 25.47,34.33 LED1.A
  Top 0.813: LED1.A 32.01,33.58 R6.2 R6.1.2
N$6
  Top 0.61: LED3.1.A 25.47,17.38 LED3.A
  Top 0.813: LED3.A 28,18.41 28,20.48 25.05,23.43 25.05,26.88 27.8,29.63 32.55,29.63 38.35,35.43 R9.2 R9.1.2
N$8
  Top 0.61: LED4.1.A 33.97,25.83 LED4.A
  Top 0.813: R10.1.2 R10.1 40.6,35.03 39.15,33.58 38.3,33.58 34.72,30 LED4.A
N$10
  Bottom 1.016: S7.1.P$5 46.79,2.56 S7.P$5
N$11
  Bottom 1.016: S7.1.P$4 38.29,2.56 S7.P$4
N$12
  Top 1.27: F1.1 44.5,38.93 F1.1.1
  Bottom 1.27: F1.1 44.5,44.58 X1.1.1 44.59,46.42 J1.1
N$14
  Top 0.813: R14.1.1 R14.1
  Bottom 0.406: U2.GPIO0 43.92,76.61 45.2,75.33 45.2,68.13 40.75,63.68 40.75,62.8 39.45,61.5 38.24,61.5 R14.1
RAW
  Top 0.61: C1.1.2 41.26,52.99 C1.2
  Top 0.813: C2.2 8.09,73.85
  Top 1.016: C2.1.2 7.79,73.65 C2.2 | C1.2.2 U6.3
  Top 1.27: C2.2 7.99,73.82 7.25,73.08 3.45,73.08 2.95,72.58 2.95,69.58 3.9,68.63 36.4,68.63 41.07,63.96 SV2.1 41.12,55.84 41.12,54.58 46.95,54.58 48.3,55.93 C1.2.2
  Bottom 0.813: XH4.P$1 32.88,85.88 32.88,87.31 31.93,88.27 19.19,88.27 17.73,86.81 17.73,86.42 XH3.P$1
  Bottom 1.016: C2.2 13.71,79.57 31.17,79.57 IC1.10 33.46,83.06 32.91,83.6 XH4.P$1 | XH3.P$1 | S7.1.P$1 S7.P$1
  Bottom 1.27: S7.1.P$1 S7.1.P$3 40.43,3.68 S7.P$3 39.15,4.96 39.15,13.68 41.9,16.43 41.9,16.48 42.1,16.68 42.1,33.23 42.45,33.58 42.45,44.58 41.3,45.73 41.3,52.95 C1.2 41.12,55.84 SV2.1
RST
  Bottom 0.406: SV2.3 35.99,61.57 37.25,62.83 39.3,62.83 39.9,63.43 39.9,64.08 43.92,68.1 U2.RST 43.95,74.47
RX
  Bottom 0.406: 34.6,80.28 34.6,82.08 35.55,83.03 39.5,83.03 41.2,81.33 U3.2
  Bottom 0.61: U2.TX 38.53,74.5 35.95,77.08 35.95,78.93 34.6,80.28 | 38.85,74.48 38.85,73.48 38.45,73.08 38.45,71.14 SV3.2
  Bottom 0.813: 38.85,74.48 U2.TX
S1
  Top 0.813: R1.1.1 R1.1 | R2.1.2 R2.2
  Bottom 1.016: R1.1 15.35,39.19 | 15.35,39.19 18,39.19 S1.1.3 21.63,39.54 S1.3 S1.4 28.49,39.54 S1.1.4 | 15.35,39.19 R2.2
S2
  Top 0.813: R3.1.2 R3.2 | R2.1.1 R2.1
  Bottom 0.813: R3.2 12.44,16.93 S2.1.3 10.49,21.66 S2.3 S2.4 10.27,31.16 S2.1.4 12.64,33.53 R2.1
S3
  Top 0.813: R3.1.1 R3.1 | R4.1.2 R4.2
  Bottom 0.813: R4.2 34.98,8.08 32.48,10.57 S3.1.3 30.97,10.34 S3.3 S3.4 21.47,10.57 S3.1.4 14.62,10.57 R3.1
S4
  Top 0.813: R5.1.1 R5.1
  Bottom 0.813: R5.1 37.3,16.67 S4.1.4 39.68,19.05 S4.4 S4.3 39.68,31.11 S4.1.3
S5
  Top 0.813: R4.1.1 R4.1 | R5.1.2 R5.2
  Top 1.016: R4.1 31.2,17.87 S5.1.4
  Bottom 0.813: S5.3 18.91,22.8 S5.1.3
  Bottom 1.016: R5.2 37.3,11.77 R4.1 | S5.3 S5.4 30.98,22.8 S5.1.4
TX
  Top 0.61: R12.1.1 36.1,73.62 | 36.1,73.62 R12.1 | 36.1,73.62 37.41,73.62 37.95,73.08 40.45,73.08 41.07,72.46 SV3.1
TX3V3
  Top 0.406: R12.1.2 36.1,78.23
  Top 0.61: U2.RX | R13.1.2 R13.1 33.01,78.15 R12.2 | R12.1.2 36.1,81.14 R12.2 | U3.1 37.17,80.07 R12.2
  Bottom 0.61: U3.1 40.41,78.33 45.17,78.33 U2.RX

### Text on the board
Top: 1723 | escornabot.com | CC BY-SA 4.0
Bottom: 1723 | CPU 2.12 | CC BY-SA 4.0 | escornabot.com | XDeSIG
tPlace: Motor Left | Motor Right | XDeSIG | BT | escornabot.com | ESP-01 | Rx | Tx | 3V3 | D11 | 5V | A0 | A2 | A4 | A6 | GND | 3V3 | D12 | 5V | D13 | A1 | A3 | A5 | GND | Arduino Nano | OLED I2C | Raw | BUZ / On | SDA SCL 5V GND | 6V | + | ON | CPU 2.12 | CC BY-SA 4.0 | escornabot.com
bPlace: Motor Left | Motor Right | XDeSIG | Tx | Rx | 5V | BT | ESP-01 | 3V3 | connector | Expansion | D11 | 5V | A0 | A2 | A4 | A6 | GND | 3V3 | D12 | 5V | D13 | A1 | A3 | A5 | GND | 3V3 / select | GND | + | http://escornabot.com | + | L-on | CC BY-SA 4.0
tNames: C2.1
Measures: Attribution-ShareAlike 4.0 International (CC BY-SA 4.0)
tDocu: Attribution-ShareAlike 4.0 International (CC BY-SA 4.0)